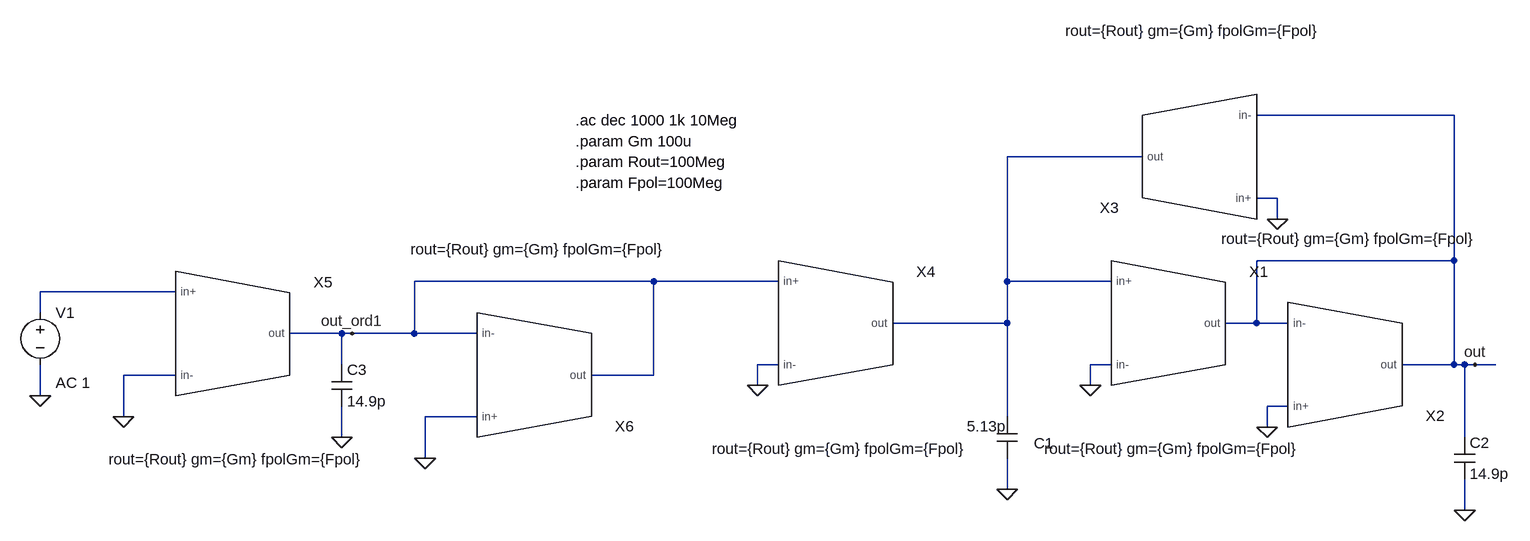
[diagram p0: schematic ImplementareGmModel.asc]
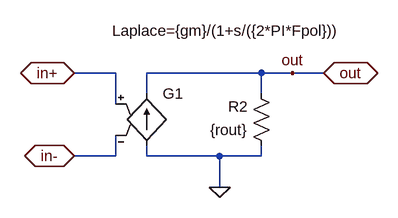
[diagram p1: sub-circuit gm_model.asc]
ImplementareGmModel.asc, the LTspice schematic file:
Version 4
SHEET 1 1588 680
WIRE 1504 -32 1200 -32
WIRE 1024 32 816 32
WIRE 1232 96 1200 96
WIRE 1232 128 1232 96
WIRE 1504 192 1504 -32
WIRE 1504 192 1200 192
WIRE 272 224 -96 224
WIRE 464 224 272 224
WIRE 816 224 816 32
WIRE 976 224 816 224
WIRE -464 240 -672 240
WIRE -672 272 -672 240
WIRE 816 288 816 224
WIRE 816 288 640 288
WIRE 1200 288 1200 192
WIRE 1200 288 1152 288
WIRE 1248 288 1200 288
WIRE -208 304 -288 304
WIRE -192 304 -208 304
WIRE -96 304 -96 224
WIRE -96 304 -192 304
WIRE 0 304 -96 304
WIRE -208 352 -208 304
WIRE 464 352 432 352
WIRE 976 352 944 352
WIRE 1504 352 1504 192
WIRE 1504 352 1424 352
WIRE 1520 352 1504 352
WIRE 1536 352 1520 352
WIRE 1568 352 1536 352
WIRE -464 368 -544 368
WIRE 272 368 272 224
WIRE 272 368 176 368
WIRE 432 384 432 352
WIRE 944 384 944 352
WIRE -672 400 -672 352
WIRE 1248 416 1216 416
WIRE -544 432 -544 368
WIRE 0 432 -80 432
WIRE 816 432 816 288
WIRE 1216 448 1216 416
WIRE -208 464 -208 416
WIRE 1520 464 1520 352
WIRE -80 496 -80 432
WIRE 816 544 816 496
WIRE 1520 576 1520 528
FLAG 1536 352 out
FLAG 1520 576 0
FLAG 816 544 0
FLAG 944 384 0
FLAG 1216 448 0
FLAG 1232 128 0
FLAG 432 384 0
FLAG -672 400 0
FLAG -192 304 out_ord1
FLAG -208 464 0
FLAG -544 432 0
FLAG -80 496 0
DATAFLAG 1360 192 ""
SYMBOL cap 800 432 R0
WINDOW 3 -46 15 Left 2
WINDOW 0 57 41 Left 2
SYMATTR Value 5.13p
SYMATTR InstName C1
SYMBOL cap 1504 464 R0
SYMATTR InstName C2
SYMATTR Value 14.9p
SYMBOL Gm_model 1200 272 R0
WINDOW 39 -128 225 Bottom 2
SYMATTR SpiceLine rout={Rout} gm={Gm} fpolGm={Fpol}
SYMATTR InstName X1
SYMBOL Gm_model 1472 368 M180
WINDOW 39 -128 225 Bottom 2
SYMATTR SpiceLine rout={Rout} gm={Gm} fpolGm={Fpol}
SYMATTR InstName X2
SYMBOL Gm_model 976 48 R180
WINDOW 39 -128 225 Bottom 2
SYMATTR SpiceLine rout={Rout} gm={Gm} fpolGm={Fpol}
SYMATTR InstName X3
SYMBOL Gm_model 688 272 R0
WINDOW 39 -128 225 Bottom 2
SYMATTR SpiceLine rout={Rout} gm={Gm} fpolGm={Fpol}
SYMATTR InstName X4
SYMBOL voltage -672 256 R0
WINDOW 123 24 124 Left 2
WINDOW 39 0 0 Left 2
SYMATTR Value2 AC 1
SYMATTR InstName V1
SYMATTR Value ""
SYMBOL cap -224 352 R0
SYMATTR InstName C3
SYMATTR Value 14.9p
SYMBOL Gm_model -240 288 R0
WINDOW 39 -128 225 Bottom 2
SYMATTR SpiceLine rout={Rout} gm={Gm} fpolGm={Fpol}
SYMATTR InstName X5
SYMBOL Gm_model 224 384 M180
WINDOW 39 -128 225 Bottom 2
SYMATTR SpiceLine rout={Rout} gm={Gm} fpolGm={Fpol}
SYMATTR InstName X6
TEXT 152 -24 Left 2 !.ac dec 1000 1k 10Meg
TEXT 152 8 Left 2 !.param Gm 100u
TEXT 152 40 Left 2 !.param Rout=100Meg
TEXT 152 72 Left 2 !.param Fpol=100Meg

gm_model.asc, the sub-circuit schematic file:
Version 4
SHEET 1 2564 1736
WIRE 1248 208 1184 208
WIRE 1472 208 1296 208
WIRE 1520 208 1472 208
WIRE 1568 208 1520 208
WIRE 1296 240 1296 208
WIRE 1472 240 1472 208
WIRE 1248 256 1248 208
WIRE 1248 336 1248 304
WIRE 1248 336 1184 336
WIRE 1296 336 1296 320
WIRE 1408 336 1296 336
WIRE 1472 336 1472 320
WIRE 1472 336 1408 336
WIRE 1408 384 1408 336
FLAG 1520 208 out
FLAG 1568 208 out
IOPIN 1568 208 BiDir
FLAG 1184 208 in+
IOPIN 1184 208 BiDir
FLAG 1184 336 in-
IOPIN 1184 336 BiDir
FLAG 1408 384 0
SYMBOL g 1296 224 R0
WINDOW 3 -53 -81 Left 2
SYMATTR Value Laplace={gm}/(1+s/({2*PI*Fpol}))
SYMATTR InstName G1
SYMBOL res 1488 336 R180
WINDOW 0 36 76 Left 2
WINDOW 3 36 40 Left 2
SYMATTR InstName R2
SYMATTR Value {rout}

The netlist it stands for:
* ImplementareGmModel.asc
C1 N001 0 5.13p
C2 out 0 14.9p
XX1 N001 0 out gm_model params: rout={Rout} gm={Gm} fpolGm={Fpol}
XX2 0 out out gm_model params: rout={Rout} gm={Gm} fpolGm={Fpol}
XX3 0 out N001 gm_model params: rout={Rout} gm={Gm} fpolGm={Fpol}
XX4 out_ord1 0 N001 gm_model params: rout={Rout} gm={Gm} fpolGm={Fpol}
V1 N002 0 AC 1
C3 out_ord1 0 14.9p
XX5 N002 0 out_ord1 gm_model params: rout={Rout} gm={Gm} fpolGm={Fpol}
XX6 0 out_ord1 out_ord1 gm_model params: rout={Rout} gm={Gm} fpolGm={Fpol}

* block symbol definitions
.subckt gm_model in+ in- out
G1 0 out in+ in- Laplace={gm}/(1+s/({2*PI*Fpol}))
R2 0 out {rout}
.ends gm_model

.ac dec 1000 1k 10Meg
.param Gm 100u
.param Rout=100Meg
.param Fpol=100Meg
.backanno
.end